# EAGLE schematic carteProto (EAGLE 6.1)
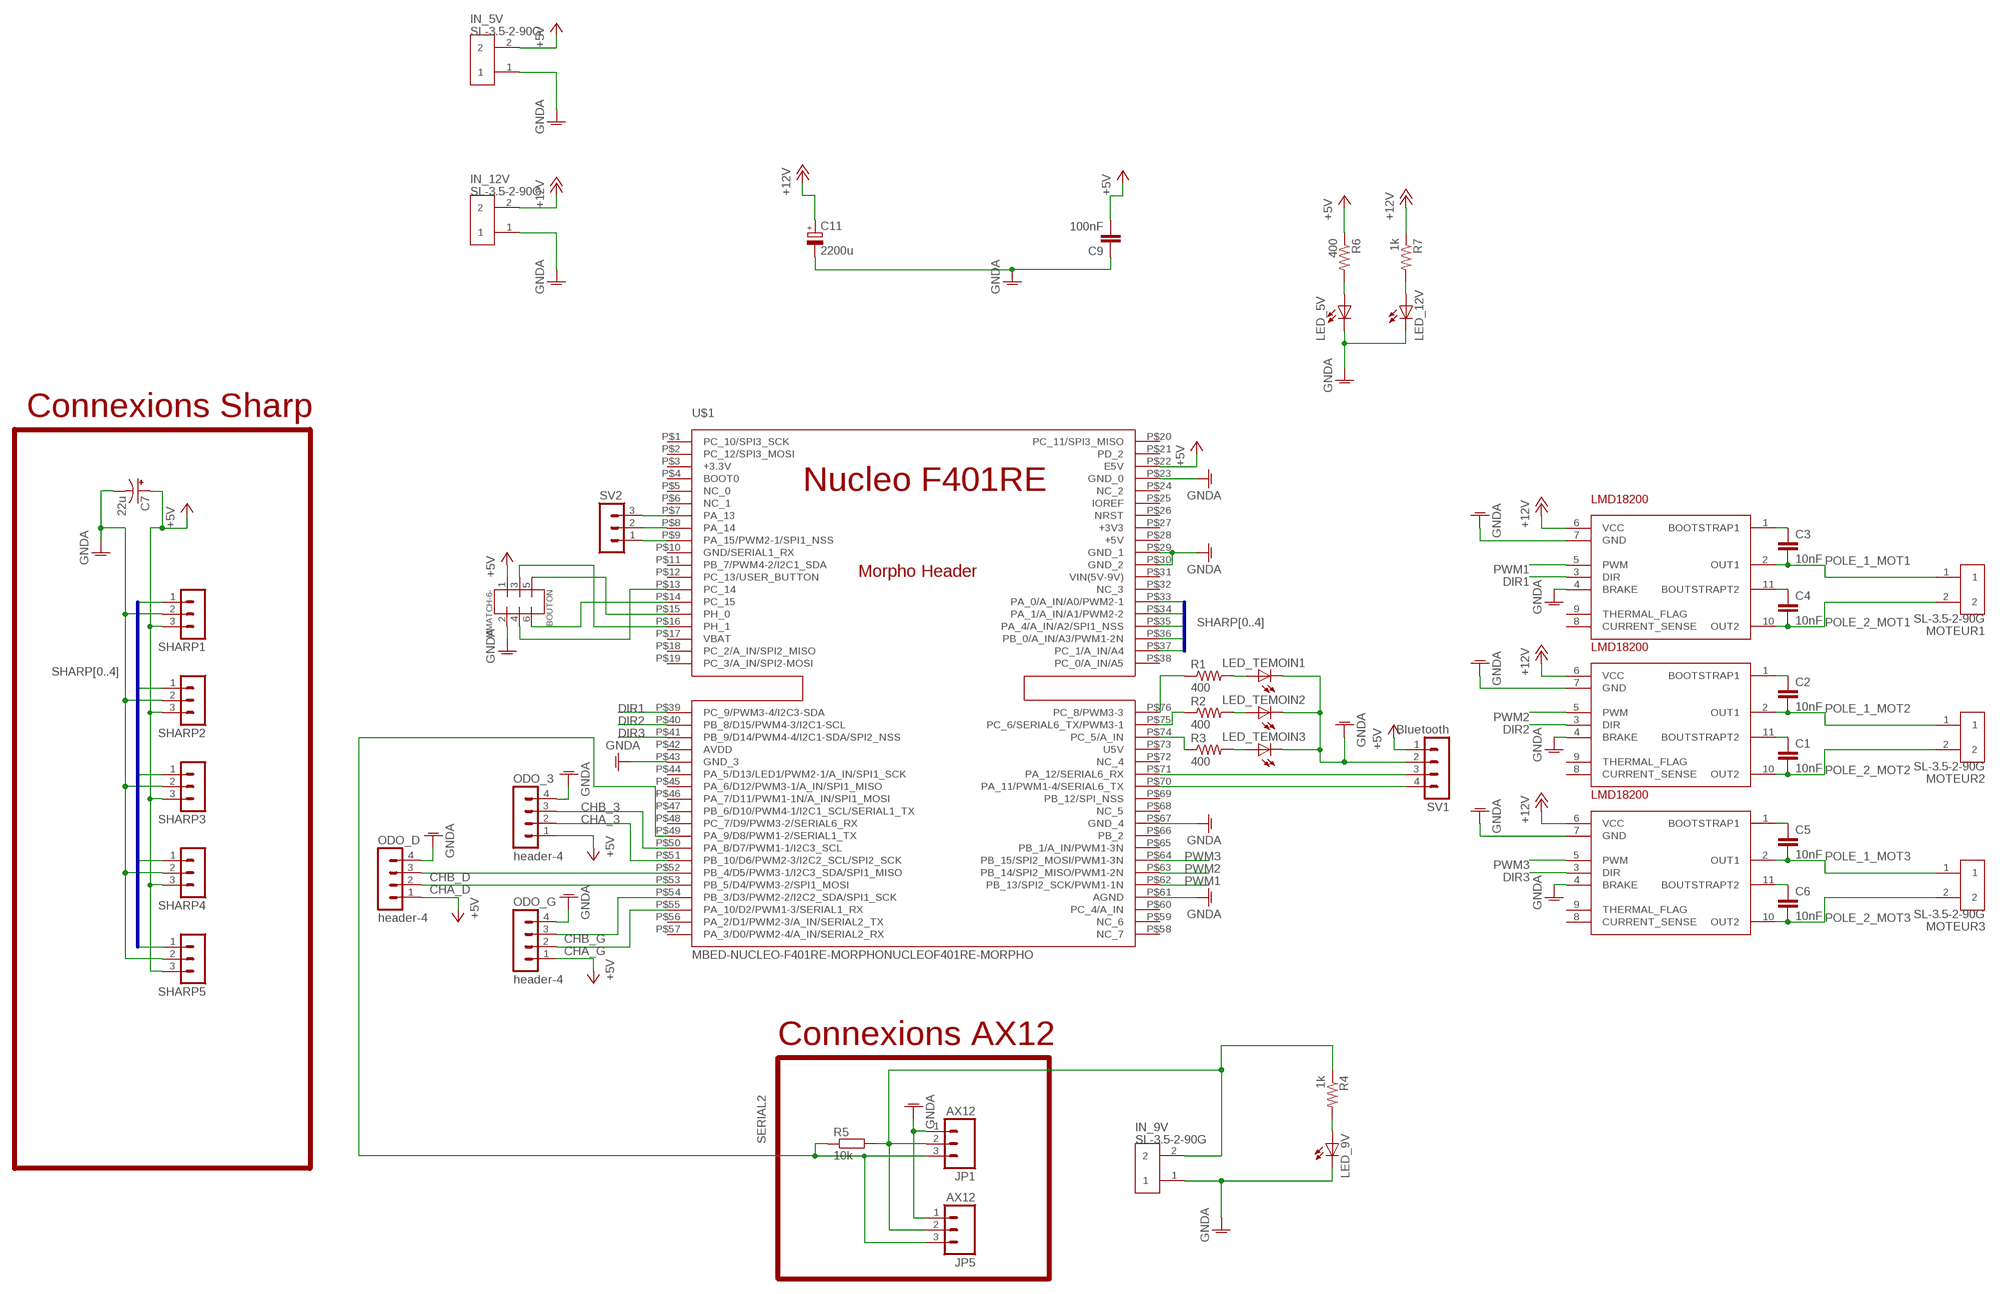
[diagram p0: schematic, sheet 1]

## Parts
BOUTON  MMATCH-6-  [AMP-215079-6]
C1  10nF  C-EUC0805  [C0805]
C2  10nF  C-EUC0805  [C0805]
C3  10nF  C-EUC0805  [C0805]
C4  10nF  C-EUC0805  [C0805]
C5  10nF  C-EUC0805  [C0805]
C6  10nF  C-EUC0805  [C0805]
C7  22u  CAP_POLPTH1  [CPOL-RADIAL-100UF-25V]
C9  100nF  C-EUC0805  [C0805]
C11  2200u  CPOL-EUTT5D11  [TT5D11]
IN_5V  SL-3.5-2-90G  [SL-3.5-2-90G]
IN_9V  SL-3.5-2-90G  [SL-3.5-2-90G]
IN_12V  SL-3.5-2-90G  [SL-3.5-2-90G]
JP1  AX12  M03POLAR  [MOLEX-1X3]
JP5  AX12  M03POLAR  [MOLEX-1X3]
LED_5V  LEDCHIPLED_0805  [CHIPLED_0805]
LED_9V  LEDCHIPLED_0805  [CHIPLED_0805]
LED_12V  LEDCHIPLED_0805  [CHIPLED_0805]
LED_TEMOIN1  LEDCHIPLED_0805  [CHIPLED_0805]
LED_TEMOIN2  LEDCHIPLED_0805  [CHIPLED_0805]
LED_TEMOIN3  LEDCHIPLED_0805  [CHIPLED_0805]
MOTEUR1  SL-3.5-2-90G  [SL-3.5-2-90G]
MOTEUR2  SL-3.5-2-90G  [SL-3.5-2-90G]
MOTEUR3  SL-3.5-2-90G  [SL-3.5-2-90G]
ODO_3  header-4  MA04-1  [MA04-1]
ODO_D  header-4  MA04-1  [MA04-1]
ODO_G  header-4  MA04-1  [MA04-1]
R1  400  RESISTOR0805-RES  [0805]
R2  400  RESISTOR0805-RES  [0805]
R3  400  RESISTOR0805-RES  [0805]
R4  1k  RESISTOR0805-RES  [0805]
R5  10k  R-EU_M0805  [M0805]
R6  400  RESISTOR0805-RES  [0805]
R7  1k  RESISTOR0805-RES  [0805]
SHARP1  MA03-1  [MA03-1]
SHARP2  MA03-1  [MA03-1]
SHARP3  MA03-1  [MA03-1]
SHARP4  MA03-1  [MA03-1]
SHARP5  MA03-1  [MA03-1]
SV1  Bluetooth  MA04-1  [MA04-1]
SV2  MA03-1  [MA03-1]
U$1  MBED-NUCLEO-F401RE-MORPHONUCLEOF401RE-MORPHO  [MORPHO-HEADERS]
U$2  LMD18200  [LMD18200]
U$3  LMD18200  [LMD18200]
U$4  LMD18200  [LMD18200]

## Nets
+5V: BOUTON.1 C7.1(+) C9.2 IN_5V.2 ODO_3.1 ODO_D.1 ODO_G.1 R6.1 SHARP1.3 SHARP2.3 SHARP3.3 SHARP4.3 SHARP5.3 SV1.1 U$1.P$22(E5V)
+12V: C11.+ IN_12V.2 R7.1 U$2.6(VCC) U$3.6(VCC) U$4.6(VCC)
CHA_3: ODO_3.2 U$1.P$51(PB_10/D6/PWM2-3/I2C2_SCL/SPI2_SCK)
CHA_D: ODO_D.2 U$1.P$53(PB_5/D4/PWM3-2/SPI1_MOSI)
CHA_G: ODO_G.2 U$1.P$55(PA_10/D2/PWM1-3/SERIAL1_RX)
CHB_3: ODO_3.3 U$1.P$50(PA_8/D7/PWM1-1/I2C3_SCL)
CHB_D: ODO_D.3 U$1.P$52(PB_4/D5/PWM3-1/I2C3_SDA/SPI1_MISO)
CHB_G: ODO_G.3 U$1.P$54(PB_3/D3/PWM2-2/I2C2_SDA/SPI1_SCK)
DIR1: U$1.P$39(PC_9/PWM3-4/I2C3-SDA) U$2.3(DIR)
DIR2: U$1.P$40(PB_8/D15/PWM4-3/I2C1-SCL) U$3.3(DIR)
DIR3: U$1.P$41(PB_9/D14/PWM4-4/I2C1-SDA/SPI2_NSS) U$4.3(DIR)
GNDA: BOUTON.2 C7.2(-) C9.1 C11.- IN_5V.1 IN_9V.1 IN_12V.1 JP1.1 JP5.1 LED_5V.C LED_9V.C LED_12V.C LED_TEMOIN1.C LED_TEMOIN2.C LED_TEMOIN3.C ODO_3.4 ODO_D.4 ODO_G.4 SHARP1.2 SHARP2.2 SHARP3.2 SHARP4.2 SHARP5.2 SV1.2 U$1.P$23(GND_0) U$1.P$29(GND_1) U$1.P$30(GND_2) U$1.P$43(GND_3) U$1.P$61(AGND) U$1.P$67(GND_4) U$2.4(BRAKE) U$2.7(GND) U$3.4(BRAKE) U$3.7(GND) U$4.4(BRAKE) U$4.7(GND)
N$1: C1.1 U$3.11(BOUTSTRAPT2)
N$2: C5.1 U$4.1(BOOTSTRAP1)
N$3: C2.1 U$3.1(BOOTSTRAP1)
N$4: C6.1 U$4.11(BOUTSTRAPT2)
N$5: C3.1 U$2.1(BOOTSTRAP1)
N$6: SV1.3 U$1.P$71(PA_12/SERIAL6_RX)
N$7: C4.1 U$2.11(BOUTSTRAPT2)
N$8: SV1.4 U$1.P$70(PA_11/PWM1-4/SERIAL6_TX)
N$9: LED_5V.A R6.2
N$10: LED_TEMOIN3.A R3.2
N$11: LED_12V.A R7.2
N$12: R1.1 U$1.P$76(PC_8/PWM3-3)
N$13: R2.1 U$1.P$75(PC_6/SERIAL6_TX/PWM3-1)
N$14: R3.1 U$1.P$74(PC_5/A_IN)
N$15: LED_TEMOIN1.A R1.2
N$16: LED_TEMOIN2.A R2.2
N$17: BOUTON.3 U$1.P$16(PH_1)
N$18: BOUTON.5 U$1.P$15(PH_0)
N$19: BOUTON.6 U$1.P$14(PC_15)
N$20: BOUTON.4 U$1.P$13(PC_14)
N$21: SV2.3 U$1.P$7(PA_13)
N$22: SV2.2 U$1.P$8(PA_14)
N$23: SV2.1 U$1.P$9(PA_15/PWM2-1/SPI1_NSS)
N$24: IN_9V.2 JP1.2 JP5.2 R4.1 R5.2
N$25: LED_9V.A R4.2
POLE_1_MOT1: C3.2 MOTEUR1.1 U$2.2(OUT1)
POLE_1_MOT2: C2.2 MOTEUR2.1 U$3.2(OUT1)
POLE_1_MOT3: C5.2 MOTEUR3.1 U$4.2(OUT1)
POLE_2_MOT1: C4.2 MOTEUR1.2 U$2.10(OUT2)
POLE_2_MOT2: C1.2 MOTEUR2.2 U$3.10(OUT2)
POLE_2_MOT3: C6.2 MOTEUR3.2 U$4.10(OUT2)
PWM1: U$1.P$62(PB_13/SPI2_SCK/PWM1-1N) U$2.5(PWM)
PWM2: U$1.P$63(PB_14/SPI2_MISO/PWM1-2N) U$3.5(PWM)
PWM3: U$1.P$64(PB_15/SPI2_MOSI/PWM1-3N) U$4.5(PWM)
SERIAL2: JP1.3 JP5.3 R5.1 U$1.P$49(PA_9/D8/PWM1-2/SERIAL1_TX)
SHARP0: SHARP1.1 U$1.P$33(PA_0/A_IN/A0/PWM2-1)
SHARP1: SHARP2.1 U$1.P$34(PA_1/A_IN/A1/PWM2-2)
SHARP2: SHARP3.1 U$1.P$35(PA_4/A_IN/A2/SPI1_NSS)
SHARP3: SHARP4.1 U$1.P$36(PB_0/A_IN/A3/PWM1-2N)
SHARP4: SHARP5.1 U$1.P$37(PC_1/A_IN/A4)
Unconnected: U$1.P$1(PC_10/SPI3_SCK) U$1.P$2(PC_12/SPI3_MOSI) U$1.P$3(+3.3V) U$1.P$4(BOOT0) U$1.P$5(NC_0) U$1.P$6(NC_1) U$1.P$10(GND/SERIAL1_RX) U$1.P$11(PB_7/PWM4-2/I2C1_SDA) U$1.P$12(PC_13/USER_BUTTON) U$1.P$17(VBAT) U$1.P$18(PC_2/A_IN/SPI2_MISO) U$1.P$19(PC_3/A_IN/SPI2-MOSI) U$1.P$20(PC_11/SPI3_MISO) U$1.P$21(PD_2) U$1.P$24(NC_2) U$1.P$25(IOREF) U$1.P$26(NRST) U$1.P$27(+3V3) U$1.P$28(+5V) U$1.P$31(VIN(5V-9V)) U$1.P$32(NC_3) U$1.P$38(PC_0/A_IN/A5) U$1.P$42(AVDD) U$1.P$44(PA_5/D13/LED1/PWM2-1/A_IN/SPI1_SCK) U$1.P$45(PA_6/D12/PWM3-1/A_IN/SPI1_MISO) U$1.P$46(PA_7/D11/PWM1-1N/A_IN/SPI1_MOSI) U$1.P$47(PB_6/D10/PWM4-1/I2C1_SCL/SERIAL1_TX) U$1.P$48(PC_7/D9/PWM3-2/SERIAL6_RX) U$1.P$56(PA_2/D1/PWM2-3/A_IN/SERIAL2_TX) U$1.P$57(PA_3/D0/PWM2-4/A_IN/SERIAL2_RX) U$1.P$58(NC_7) U$1.P$59(NC_6) U$1.P$60(PC_4/A_IN) U$1.P$65(PB_1/A_IN/PWM1-3N) U$1.P$66(PB_2) U$1.P$68(NC_5) U$1.P$69(PB_12/SPI_NSS) U$1.P$72(NC_4) U$1.P$73(U5V) U$2.8(CURRENT_SENSE) U$2.9(THERMAL_FLAG) U$3.8(CURRENT_SENSE) U$3.9(THERMAL_FLAG) U$4.8(CURRENT_SENSE) U$4.9(THERMAL_FLAG)

## Buses
SHARP[0..4]

## Notes on the sheet
- Connexions Sharp
- Connexions AX12

## Library data of the parts
BOUTON = jt-con-micromatch:MMATCH-6-*
C1-C6 C9 = rcl:C-EU: CAPACITOR, European symbol
C7 = SparkFun-Capacitors:CAP_POL: Capacitor Polarized These are standard SMD and PTH capacitors. Normally 10uF, 47uF, and 100uF in electrolytic and tantalum varieties. Always verify the external diameter of the through hole cap, it varies with capacity, voltage, and manufacturer. The EIA devices should be standard.
C11 = rcl:CPOL-EU: POLARIZED CAPACITOR, European symbol
IN_5V IN_9V IN_12V MOTEUR1-MOTEUR3 = WEIDMULLER:SL-3.5-2-90G
JP1 JP5 = SparkFun-Connectors:M03: Header 3 Standard 3-pin 0.1" header. Use with straight break away headers (SKU : PRT-00116), right angle break away headers (PRT-00553), swiss pins (PRT-00743), machine pins (PRT-00117), and female headers (PRT-00115). Molex polarized connector foot print use with SKU : PRT-08232 with associated crimp pins and housings.
LED_5V LED_9V LED_12V LED_TEMOIN1-LED_TEMOIN3 = adafruit:LED: LED OSRAM: - CHIPLED LG R971, LG N971, LY N971, LG Q971, LY Q971, LO R971, LY R971 LH N974, LH R974 LS Q976, LO Q976, LY Q976 LO Q996 - Hyper CHIPLED LW Q18S LB Q993, LB Q99A, LB R99A - SideLED LS A670, LO A670, LY A670, LG A670, LP A670 LB A673, LV A673, LT A673, LW A673 LH A674 LY A675 LS A676, LA A676, LO A676, LY A676, LW A676 LS A679, LY A679, LG A679 - Hyper Micro SIDELED® LS Y876, LA Y876, LO Y876, LY Y876 LT Y87S - SmartLED LW L88C, LW L88S LB L89C, LB L89S, LG L890 LS L89K, LO L89K, LY L89K LS L896, LA L896, LO L896, LY L896 - TOPLED LS T670, LO T670, LY T670, LG T670, LP T670 LSG T670, LSP T670, LSY T670, LOP T670, LYG T670 LG T671, LOG T671, LSG T671 LB T673, LV T673, LT T673, LW T673 LH T674 LS T676, LA T676, LO T676, LY T676, LB T676, LH T676, LSB T676, LW T676 LB T67C, LV T67C, LT T67C, LS T67K, LO T67K, LY T67K, LW E67C LS E67B, LA E67B, LO E67B, LY E67B, LB E67C, LV E67C, LT E67C LW T67C LS T679, LY T679, LG T679 LS T770, LO T770, LY T770, LG T770, LP T770 LB T773, LV T773, LT T773, LW T773 LH T774 LS E675, LA E675, LY E675, LS T675 LS T776, LA T776, LO T776, LY T776, LB T776 LHGB T686 LT T68C, LB T68C - Hyper Mini TOPLED® LB M676 - Mini TOPLED Santana® LG M470 LS M47K, LO M47K, LY M47K Source: http://www.osram.convergy.de/
ODO_3 ODO_D ODO_G SV1 = con-lstb:MA04-1: PIN HEADER; OC_FARNELL: unknown; OC_NEWARK: unknown
R1-R4 R6 R7 = SparkFun-Passives:RESISTOR: Resistor Basic schematic elements and footprints for 0603, 1206, and PTH resistors.; OC_FARNELL: unknown
R5 = rcl:R-EU_: RESISTOR, European symbol
SHARP1-SHARP5 SV2 = con-lstb:MA03-1: PIN HEADER; OC_FARNELL: unknown; OC_NEWARK: unknown
U$1 = mbed-nucleo:MBED-NUCLEO-F401RE-MORPHO
U$2-U$4 = texas:LMD18200